# EAGLE board LED (EAGLE 9.5.2)
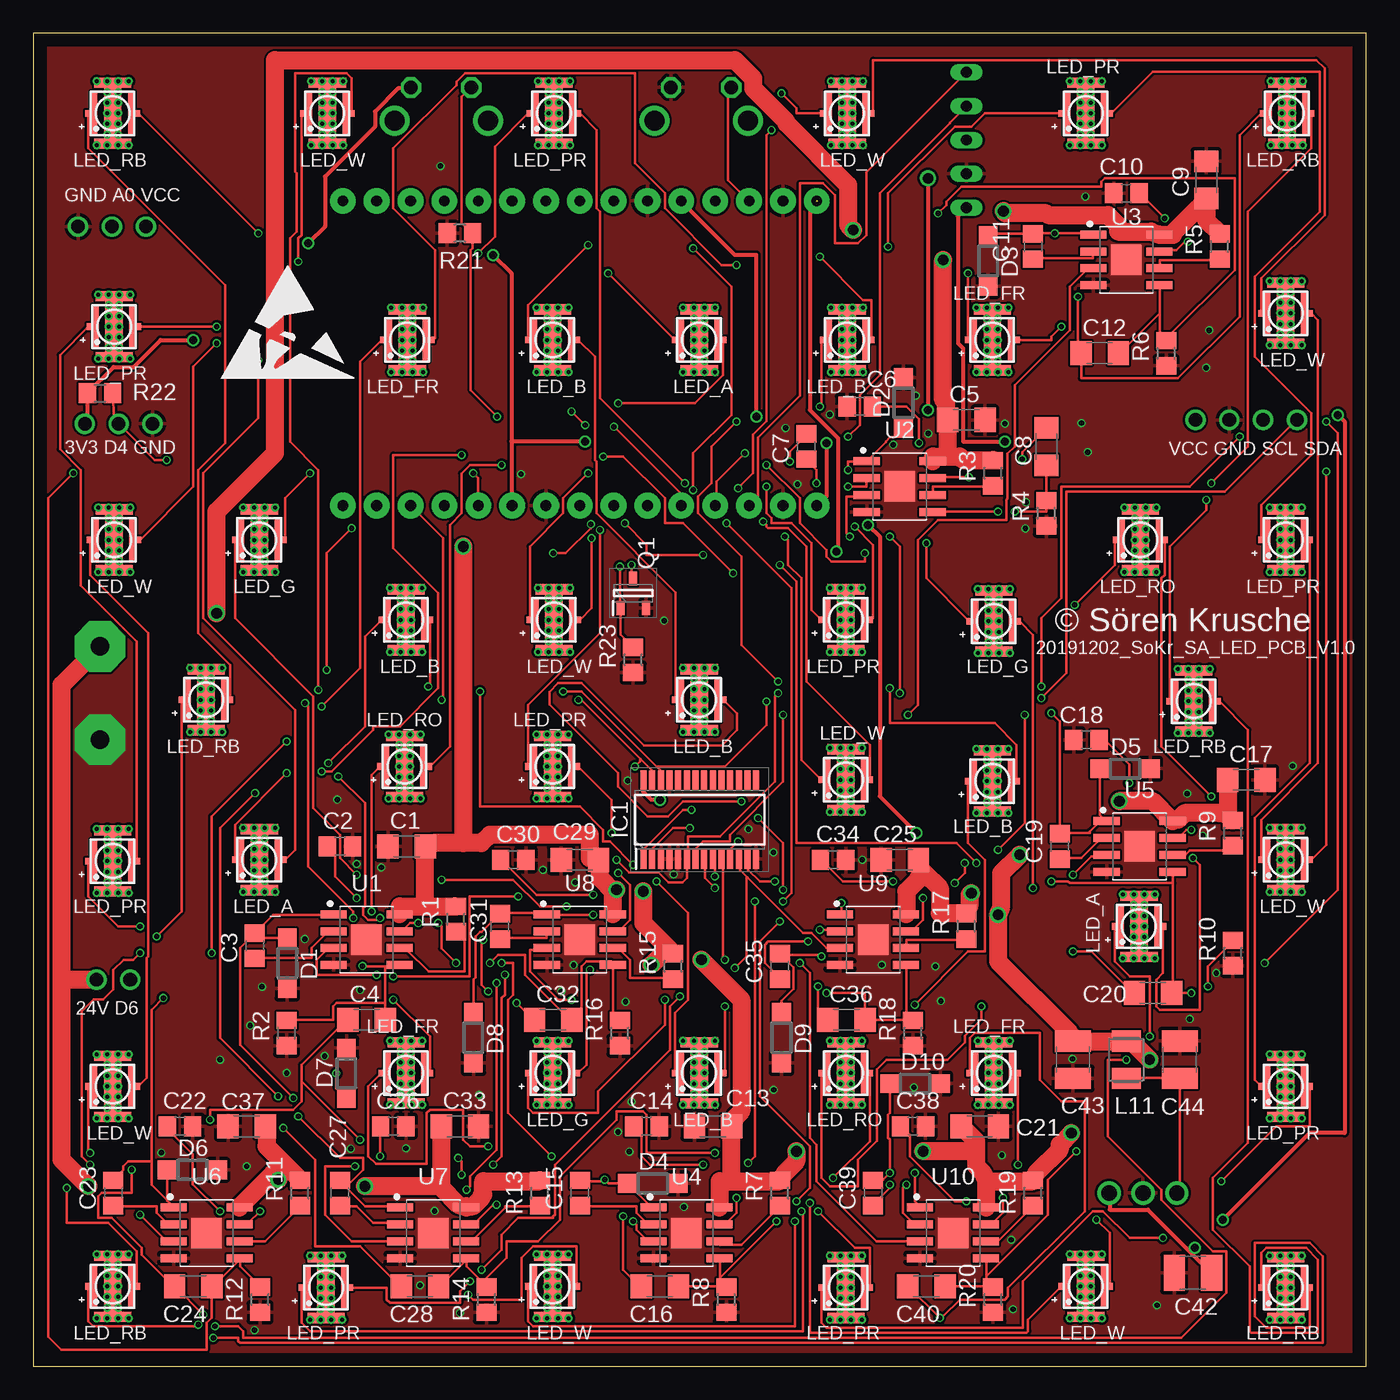
[diagram p5: board, top side]
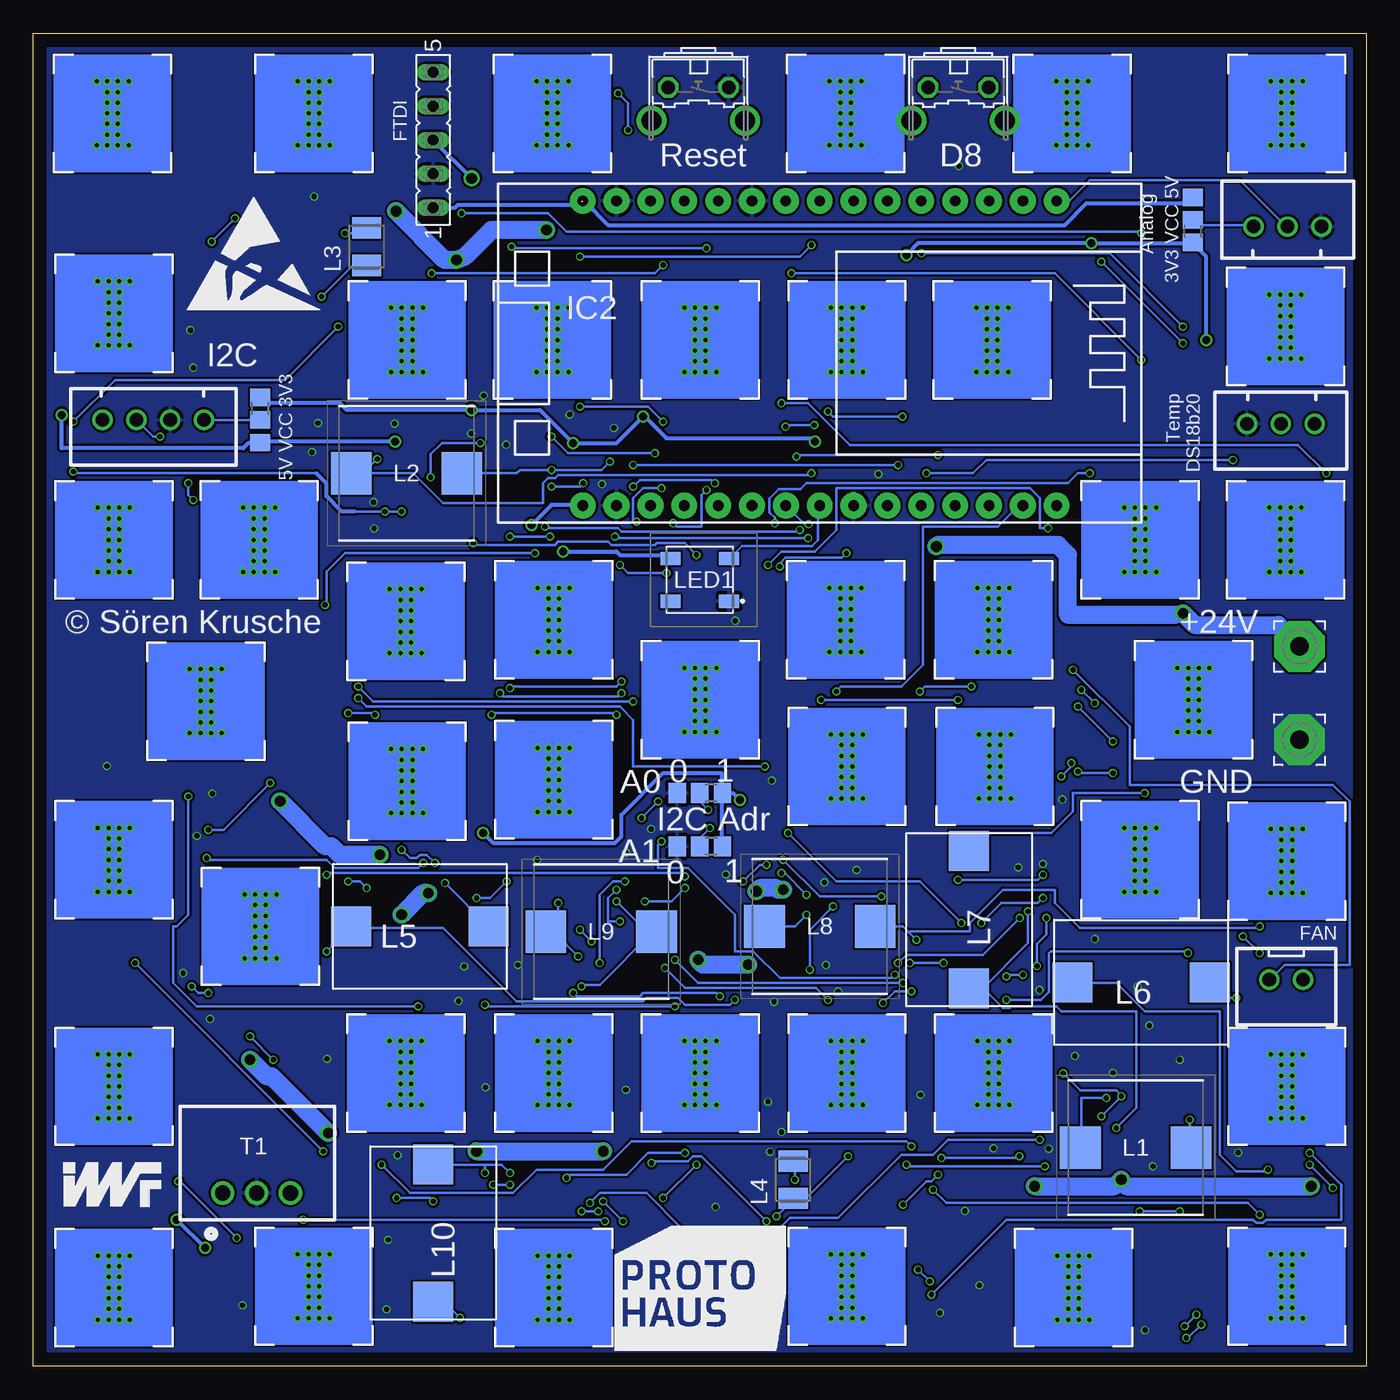
[diagram p6: board, bottom side, seen from below]

Size 100 x 100 mm. Coordinates in mm from the lower left corner, seen from the top.
Outline: 0,0 100,0 100,100 0,100 0,0
Copper layers (1*16): Top 0.035mm / dielectric 1.5mm / Bottom 0.035mm
Design rules "default *": minimum track width 5mil, minimum drill 0.3mm, track to track 5mil, track to pad 5mil, pad to pad 5mil, via to via 5mil, smd to smd 5mil, copper to edge 40mil, drill to drill 6mil, minimum pad ring 3mil, minimum via ring 3mil, stop-mask expansion 4mil, vias tented up to drill 0mil, thermal gap 10mil
Net classes: 0 min: width 0.178 mm, drill 0.4 mm, clearance 0.178 mm; 1 1A: width 0.305 mm, drill 0.6 mm, clearance 0.178 mm to class 0, clearance 0.178 mm; 2 2A: width 0.762 mm, drill 0.8 mm, clearance 0.178 mm to class 0, clearance 0.178 mm to class 1, clearance 0.178 mm; 3 PWM: width 0.178 mm, drill 0.4 mm, clearance 0.178 mm to class 0, clearance 0.178 mm to class 1, clearance 0.178 mm to class 2, clearance 0.178 mm; 4 3A: width 1.346 mm, drill 0.8 mm, clearance 0.178 mm to class 0, clearance 0.178 mm to class 1, clearance 0.178 mm to class 2, clearance 0.178 mm to class 3, clearance 0.178 mm

## Footprints (pad centres in the part's own frame; a part is rotated, then mirrored left to right if it is on the bottom)
C1206 = smd 1.6 x 1.8: 1 -1.4,0; 2 1.4,0
C0805 = smd 1.3 x 1.5: 1 -0.95,0; 2 0.95,0
C1210 = smd 1.6 x 2.7: 1 -1.4,0; 2 1.4,0
SOD123 = smd 1.4 x 1.4: A 1.9,0; C -1.9,0
SOP65P640X110-28N = smd 1.475 x 0.45: 1 -2.938,4.225; 2 -2.938,3.575; 3 -2.938,2.925; 4 -2.938,2.275; 5 -2.938,1.625; 6 -2.938,0.975; 7 -2.938,0.325; 8 -2.938,-0.325; 9 -2.938,-0.975; 10 -2.938,-1.625; 11 -2.938,-2.275; 12 -2.938,-2.925; 13 -2.938,-3.575; 14 -2.938,-4.225; 15 2.938,-4.225; 16 2.938,-3.575; 17 2.938,-2.925; 18 2.938,-2.275; 19 2.938,-1.625; 20 2.938,-0.975; 21 2.938,-0.325; 22 2.938,0.325; 23 2.938,0.975; 24 2.938,1.625; 25 2.938,2.275; 26 2.938,2.925; 27 2.938,3.575; 28 2.938,4.225
ESP12E_DEVKIT = drill 0.8 pad 1.93: 3V3@0 -11.43,-7.62; 3V3@1 11.43,5.08; 3V3@2 11.43,-17.78; AD0 -11.43,17.78; CLK -11.43,-2.54; CMD -11.43,2.54; D0 11.43,17.78; D1 11.43,15.24; D2 11.43,12.7; D3 11.43,10.16; D4 11.43,7.62; D5 11.43,0; D6 11.43,-2.54; D7 11.43,-5.08; D8 11.43,-7.62; EN -11.43,-10.16; GND@0 -11.43,-5.08; GND@1 -11.43,-15.24; GND@2 11.43,2.54; GND@3 11.43,-15.24; RST -11.43,-12.7; RSV@0 -11.43,15.24; RSV@1 -11.43,12.7; RX 11.43,-10.16; SD0 -11.43,0; SD1 -11.43,5.08; SD2 -11.43,7.62; SD3 -11.43,10.16; TX 11.43,-12.7; VIN -11.43,-17.78
A0R-JMP = smd 1.5 x 1.3: 1 0,1.7; 2 0,0; 3 0,-1.7
INDPM101101X680N = smd 3.05 x 3.2: 1 -4.15,0; 2 4.15,0
L3225M = smd 1.6 x 2.2: 1 -1.4,0; 2 1.4,0
PF0382.223NLT = smd 3 x 3: P0 -5.15,0; P1 5.15,0
INPI554FCH = smd 1.5 x 1: 1 2.2,-1.6; 2 2.2,1.6; 3 -2.2,1.6; 4 -2.2,-1.6
CREE_XLAMP = smd 0.5 x 3.3: A -1.4,0; C 1.4,0 | smd 0.45 x 0.5: A@1 -1.825,0; C@1 1.825,0 | drill 0.3 pad 0.6: P$1 0.4,0; P$2 -0.4,0; P$3 0.4,-0.8; P$4 -0.4,-0.8; P$5 0.4,0.8; P$6 -0.4,0.8; P$7 -0.4,1.6; P$8 0.4,1.6; P$9 0.4,2.4; P$10 -0.4,2.4; P$11 1.2,2.4; P$12 -1.2,2.4; P$13 0.4,-1.6; P$14 0.4,-2.4; P$15 -0.4,-1.6; P$16 -0.4,-2.4; P$17 1.2,-2.4; P$18 -1.2,-2.4 | smd 2.794 x 0.762: P$19 0,2.286; P$20 0,-2.286 | smd 1.3 x 3.81: X 0,0
3,81/1,4 = drill 1.397 pad 3.81 octagon: 1 0,0
SOT95P230X110-3N = smd 1.05 x 0.6: 1 -1.1,0.95; 2 -1.1,-0.95; 3 1.1,0
R0805 = smd 1.3 x 1.5: 1 -0.95,0; 2 0.95,0
B3F-31XX = drill 1.016 octagon: 1 -2.261,-1.245; 2 2.261,-1.245 | drill 1.499 pad 2.159: 3 -3.505,1.245; 4 3.505,1.245
FE05-1 = drill 0.813 long: 1 -5.08,0; 2 -2.54,0; 3 0,0; 4 2.54,0; 5 5.08,0
R-78E5.0-1.0 = drill 1.15 pad 1.75: 1 3.21,2; 2 5.75,2; 3 8.29,2
SOIC127P600X170-9T228N = smd 1.968 x 0.599: 1 -2.473,1.905; 2 -2.473,0.635; 3 -2.473,-0.635; 4 -2.473,-1.905; 5 2.473,-1.905; 6 2.473,-0.635; 7 2.473,0.635; 8 2.473,1.905 | smd 2.28 x 2.28: 9 0,0
JST-XH-03-PACKAGE-ROUND-PAD = drill 1.016: 1 -2.54,0; 2 0,0; 3 2.54,0
JST-XH-04-PACKAGE-ROUND-PAD = drill 1.016: 1 -3.81,0; 2 -1.27,0; 3 1.27,0; 4 3.81,0
JST-XH-02-PACKAGE-ROUND-PAD = drill 1.016: 1 -1.27,0; 2 1.27,0

## Placement (x,y rotation side)
C1  1u  [C1206]  28,39 180 top
C2  100n  [C0805]  23,39 0 top
C3  100n  [C0805]  16.62,31.54 90 top
C4  2.2p  [C1206]  25,26 0 top
C5  1u  [C1206]  70,71 0 top
C6  100n  [C0805]  62,72 180 top
C7  100n  [C0805]  58,69 90 top
C8  2.2p  [C1206]  76,69 270 top
C9  1u  [C1206]  88,89 90 top
C10  100n  [C0805]  82,88 180 top
C11  100n  [C0805]  75,84 90 top
C12  2.2p  [C1206]  80,76 0 top
C13  1u  [C1206]  51,18 180 top
C14  100n  [C0805]  46,18 0 top
C15  100n  [C0805]  41,13 90 top
C16  2.2p  [C1206]  47,6 0 top
C17  1u  [C1206]  91,44 0 top
C18  100n  [C0805]  79,47 180 top
C19  100n  [C0805]  77,39 90 top
C20  2.2p  [C1206]  84,28 0 top
C21  1u  [C1206]  71,18 0 top
C22  100n  [C0805]  11,18 0 top
C23  100n  [C0805]  6,13 90 top
C24  2.2p  [C1206]  12,6 0 top
C25  1u  [C1206]  65,38 180 top
C26  100n  [C0805]  27,18 0 top
C27  100n  [C0805]  23,13 90 top
C28  2.2p  [C1206]  29,6 0 top
C29  1u  [C1206]  41,38 180 top
C30  100n  [C0805]  36,38 0 top
C31  100n  [C0805]  35,33 90 top
C32  2.2p  [C1206]  39,26 0 top
C33  1u  [C1206]  32,18 0 top
C34  100n  [C0805]  60,38 0 top
C35  100n  [C0805]  56,30 90 top
C36  2.2p  [C1206]  61,26 0 top
C37  1u  [C1206]  16,18 180 top
C38  100n  [C0805]  66,18 0 top
C39  100n  [C0805]  63,13 90 top
C40  2.2p  [C1206]  67,6 0 top
C42  10u  [C1210]  87,7 180 top
C43  10u  [C1210]  78,23 270 top
C44  10u  [C1210]  86,23 90 top
D1  CMHSH5-4  [SOD123]  19.05,30.23 270 top
D2  CMHSH5-4  [SOD123]  65.28,72.26 90 top
D3  CMHSH5-4  [SOD123]  71.63,82.93 270 top
D4  CMHSH5-4  [SOD123]  46.48,13.72 0 top
D5  CMHSH5-4  [SOD123]  81.92,44.83 0 top
D6  CMHSH5-4  [SOD123]  11.94,14.73 0 top
D7  CMHSH5-4  [SOD123]  23.5,21.97 90 top
D8  CMHSH5-4  [SOD123]  33.02,24.64 270 top
D9  CMHSH5-4  [SOD123]  56.13,24.64 270 top
D10  CMHSH5-4  [SOD123]  66.17,21.21 0 top
IC1  PCA9685PW,112  [SOP65P640X110-28N]  50,41 90 top
IC2  ESP12E_DEVKIT  [ESP12E_DEVKIT]  41,76 270 bottom
JMP1  0R-JUMPA  [A0R-JMP]  50,43 270 bottom
JMP2  0R-JUMPA  [A0R-JMP]  50,39 270 bottom
JMP3  0R-JUMPA  [A0R-JMP]  83,71 0 bottom
JMP4  0R-JUMPA  [A0R-JMP]  13,86 180 bottom
L1  16uH  [INDPM101101X680N]  17.3,16.4 0 bottom
L2  16uH  [INDPM101101X680N]  72,67 180 bottom
L3  10uH  [L3225M]  75,84 90 bottom
L4  10uH  [L3225M]  43,14 90 bottom
L5  20uH  [PF0382.223NLT]  71,33 180 bottom
L6  20uH  [PF0382.223NLT]  16.9,28.8 180 bottom
L7  20uH  [PF0382.223NLT]  29.8,33.5 270 bottom
L8  16uH  [INDPM101101X680N]  41,33 0 bottom
L9  16uH  [INDPM101101X680N]  57.4,32.6 0 bottom
L10  20uH  [PF0382.223NLT]  70,10 270 bottom
L11  10uH  [L3225M]  82,23 90 top
LED1  IN-PI554FCH  [INPI554FCH]  50,59 0 bottom
LED_A1  XP-G3  [CREE_XLAMP]  49.96,77 0 top
LED_A2  XP-G3  [CREE_XLAMP]  16.96,38 0 top
LED_A3  XP-G3  [CREE_XLAMP]  82.96,33 0 top
LED_B1  XP-G3  [CREE_XLAMP]  49.96,50 0 top
LED_B2  XP-G3  [CREE_XLAMP]  38.96,77 0 top
LED_B3  XP-G3  [CREE_XLAMP]  61.06,77 0 top
LED_B4  XP-G3  [CREE_XLAMP]  71.96,43.9 0 top
LED_B5  XP-G3  [CREE_XLAMP]  49.96,22 0 top
LED_B6  XP-G3  [CREE_XLAMP]  27.96,56 0 top
LED_FR1  XP-G3  [CREE_XLAMP]  71.96,77 0 top
LED_FR2  XP-G3  [CREE_XLAMP]  28.06,77 0 top
LED_FR3  XP-G3  [CREE_XLAMP]  27.96,22 0 top
LED_FR4  XP-G3  [CREE_XLAMP]  72.06,22 0 top
LED_G1  XP-G3  [CREE_XLAMP]  72.06,55.9 0 top
LED_G2  XP-G3  [CREE_XLAMP]  16.96,62 0 top
LED_G3  XP-G3  [CREE_XLAMP]  38.96,22 0 top
LED_PR1  XP-G3  [CREE_XLAMP]  38.96,45 0 top
LED_PR2  XP-G3  [CREE_XLAMP]  60.96,56 0 top
LED_PR3  XP-G3  [CREE_XLAMP]  39.06,94 0 top
LED_PR4  XP-G3  [CREE_XLAMP]  6.06,78 0 top
LED_PR5  XP-G3  [CREE_XLAMP]  5.96,37.9 0 top
LED_PR6  XP-G3  [CREE_XLAMP]  21.96,5.9 0 top
LED_PR7  XP-G3  [CREE_XLAMP]  60.96,5.9 0 top
LED_PR8  XP-G3  [CREE_XLAMP]  93.96,21 0 top
LED_PR9  XP-G3  [CREE_XLAMP]  93.96,62 0 top
LED_PR10  XP-G3  [CREE_XLAMP]  78.96,94 0 top
LED_RB1  XP-G3  [CREE_XLAMP]  5.96,94 0 top
LED_RB2  XP-G3  [CREE_XLAMP]  12.96,50 0 top
LED_RB3  XP-G3  [CREE_XLAMP]  5.96,6 0 top
LED_RB4  XP-G3  [CREE_XLAMP]  93.96,5.9 0 top
LED_RB5  XP-G3  [CREE_XLAMP]  87.06,49.9 0 top
LED_RB6  XP-G3  [CREE_XLAMP]  94.06,94 0 top
LED_RO1  XP-G3  [CREE_XLAMP]  60.96,22 0 top
LED_RO2  XP-G3  [CREE_XLAMP]  83.06,62 0 top
LED_RO3  XP-G3  [CREE_XLAMP]  27.86,45 0 top
LED_W1  XP-G3  [CREE_XLAMP]  22.06,94 0 top
LED_W2  XP-G3  [CREE_XLAMP]  6.06,62 0 top
LED_W3  XP-G3  [CREE_XLAMP]  5.96,21 0 top
LED_W4  XP-G3  [CREE_XLAMP]  38.96,6 0 top
LED_W5  XP-G3  [CREE_XLAMP]  78.96,6 0 top
LED_W6  XP-G3  [CREE_XLAMP]  93.96,38 0 top
LED_W7  XP-G3  [CREE_XLAMP]  93.96,79 0 top
LED_W8  XP-G3  [CREE_XLAMP]  61.06,94 0 top
LED_W9  XP-G3  [CREE_XLAMP]  60.96,44 0 top
LED_W10  XP-G3  [CREE_XLAMP]  39.06,56 0 top
PAD1  +24V  [3,81/1,4]  5,54 0 bottom
PAD2  GND  [3,81/1,4]  5,47 0 bottom
Q1  BSH103,215  [SOT95P230X110-3N]  45,58 90 top
R1  200k 1%  [R0805]  31.7,33.54 90 top
R2  390m  [R0805]  19,25 90 top
R3  200k 1%  [R0805]  72,67 90 top
R4  390m  [R0805]  76,64 90 top
R5  200k 1%  [R0805]  89,84 90 top
R6  300m  [R0805]  85,76 90 top
R7  200k 1%  [R0805]  56,13 90 top
R8  240m  [R0805]  52,5 90 top
R9  59k 1%  [R0805]  90,40 90 top
R10  470m  [R0805]  90,31 90 top
R11  59k 1%  [R0805]  20,13 90 top
R12  470m  [R0805]  17,5 90 top
R13  59k 1%  [R0805]  38,13 90 top
R14  470m  [R0805]  34,5 90 top
R15  59k 1%  [R0805]  48,30 90 top
R16  470m  [R0805]  44,25 90 top
R17  59k 1%  [R0805]  70,33 90 top
R18  470m  [R0805]  66,25 90 top
R19  59k 1%  [R0805]  75,13 90 top
R20  470m  [R0805]  72,5 90 top
R21  4k7  [R0805]  32,85 180 top
R22  4k7  [R0805]  5,73 0 top
R23  4k7  [R0805]  45,53 90 top
S1  D8  [B3F-31XX]  30.6,94.7 180 bottom
S2  RST  [B3F-31XX]  50.1,94.7 180 bottom
SV1  FTDI  [FE05-1]  70,92 90 bottom
T1  R-78E5.0-1.0  [R-78E5.0-1.0]  89,11 0 bottom
U1  LM3402/02HV  [SOIC127P600X170-9T228N]  25,32 0 top
U2  LM3402/02HV  [SOIC127P600X170-9T228N]  65,66 0 top
U3  LM3402/02HV  [SOIC127P600X170-9T228N]  82,83 0 top
U4  LM3402/02HV  [SOIC127P600X170-9T228N]  49,10 0 top
U5  LM3402/02HV  [SOIC127P600X170-9T228N]  83,39 0 top
U6  LM3402/02HV  [SOIC127P600X170-9T228N]  13,10 0 top
U7  LM3402/02HV  [SOIC127P600X170-9T228N]  30,10 0 top
U8  LM3402/02HV  [SOIC127P600X170-9T228N]  41,32 0 top
U9  LM3402/02HV  [SOIC127P600X170-9T228N]  63,32 0 top
U10  LM3402/02HV  [SOIC127P600X170-9T228N]  69,10 0 top
U$1  [ESD_10.00]  14,74 0 top
U$2  [ESD_10.00]  88.55,79.13 0 bottom
X1  JST-XH-03-PIN-ROUND-PAD  [JST-XH-03-PACKAGE-ROUND-PAD]  5.9,85.5 0 bottom
X2  JST-XH-04-PIN-ROUND-PAD  [JST-XH-04-PACKAGE-ROUND-PAD]  91,71 180 bottom
X3  JST-XH-03-PIN-ROUND-PAD  [JST-XH-03-PACKAGE-ROUND-PAD]  6.4,70.71 180 bottom
X4  JST-XH-02-PIN-ROUND-PAD  [JST-XH-02-PACKAGE-ROUND-PAD]  6,29 180 bottom

## Tracks (layer width: path | path; a pad name or v marks a point on that pad's centre or on a via)
+3V3  (via drill 0.6, 0.8)
  Top 0.305: v20.62,84.25 21.88,85.5 21.88,89.25 25.62,93 25.62,94.12 27.38,95.88 28.25,95.88 S1.1 | 35.88,69.38 35.88,82 v34.5,83.38 | 35.88,69.38 35.88,64.62 IC2.3V3@1 | v47,42.5 46.38,42.5 45.75,43.12 45.75,43.88 IC1.28 | v67.12,89.12 v67.12,71.75 | v59.5,69.25 59.5,65.25 58.88,64.62 IC2.3V3@2 | v54.25,71.25 54.25,83.38 52.62,83.38 48.62,87.38 IC2.3V3@0 | v66.25,40 63.5,42.75 63.5,62.25 v62.62,63.12 | v41.38,69.38 35.88,69.38 | X3.1 4.05,70.9 R22.1 6.02,74.97 7.52,74.97 9.55,77 v12,77
  Bottom 0.305: 13,84.25 v20.62,84.25 33.62,84.25 v34.5,83.38 | 13,84.25 JMP4.1 | v47,42.5 47.5,43 JMP1.1 | JMP2.1 48.38,39 48.38,42.88 JMP1.1 | SV1.3 v67.12,89.12 | JMP3.1 83,72.62 82.62,72.25 77,72.25 76.5,71.75 v67.12,71.75 62,71.75 v59.5,69.25 56.25,69.25 v54.25,71.25 54.12,71.25 52.5,69.62 41.62,69.62 v41.38,69.38 | v66.25,40 65.5,39.25 56.38,39.25 55.88,39.75 55.88,41.38 52.75,44.5 48.38,44.5 48.38,43.12 JMP1.1 | v62.62,63.12 61.12,64.62 58.88,64.62 IC2.3V3@2 | v12,77 12,83.25 13,84.25
+5V  (via drill 0.6)  (3 unrouted)
  Top 0.305: v60.25,61.12 60.38,61.25 60.38,69.62 58.25,71.75 58.25,86.88 58.75,87.38 | 86.81,8.56 83.62,11.75 80.75,11.75 80.75,13 T1.3 | 86.81,8.56 88.38,7 C42.1 | v72.88,69.38 69.75,69.38 69.75,76.38 69.38,76.75 69.38,86 69.38,86.25 69.38,86.3 SV1.1 | v87.12,8.88 86.81,8.56 | v89.25,11 95.75,17.5 98.38,17.5 98.38,70.88 v97.88,71.38
  Bottom 0.305: v60.25,61.12 56.25,61.12 56,60.88 52.5,60.88 52.25,60.62 LED1.3 | 58.75,87.38 58.62,87.38 56.88,85.62 22.62,85.62 21,87.25 13.38,87.25 13,87.62 JMP4.3 | v72.88,69.38 83,69.38 JMP3.3 83.12,69.25 83.88,69.25 84.25,68.88 97.88,68.88 v97.88,71.38 | v89.25,11 v87.12,8.88 | SV1.1 68.35,86.92 68.14,87.13 59.12,87.13 58.88,87.38
+24V  (via drill 0.8)
  Top 1.346: 52.38,13.88 51.5,13.88 51.5,12 U4.8 | 52.38,13.88 56,13.88 R7.2 56.38,14.5 57.25,15.38 v57.25,16.12 | 52.38,13.88 52.38,18 C13.1 52.62,18.62 53.12,19.12 53.12,27.5 v50.12,30.5 | 29.38,34.5 27.5,34.5 27.5,34 U1.8 | 29.38,34.5 31.62,34.5 R1.2 | 29.38,34.5 29.38,39 C1.1 30,39.25 32.25,39.25 | 47.56,31.44 45.75,33.25 v45.75,35.62 | 47.56,31.44 48,31 R15.2 | 43.56,35.56 43.5,35.5 43.5,34 U8.8 | 43.56,35.56 v43.75,35.75 | 43.56,35.56 42.5,36.62 42.5,38 C29.1 41.75,38.12 41.75,39.88 34.25,39.88 33.62,39.25 32.25,39.25 | v46.38,30.12 47.12,30.88 47.12,31 47.56,31.44 | 71.5,13.88 75,13.88 R19.2 75.25,14.5 77,16.25 77,16.62 v77.88,17.5 | 71.5,13.88 71.5,12 U10.8 | 70.75,16.12 70.75,15 71.25,14.5 71.5,13.88 | 70.75,16.12 70.75,16.88 69.62,18 C21.1 | 89.62,41.38 90,41 R9.2 | 89.62,41.38 89.62,44 C17.1 | 89.62,41.38 89,41.5 86.38,41.5 85.88,41 85.5,41 U5.8 83.98,42.4 v81.49,42.4 | 70,34 68,34 68,35.88 66.81,37.06 | 66.81,37.06 66.5,37.38 66.5,38 C25.1 | 70,34 R17.2 | U9.8 65.5,34 65.5,35.62 66.38,36.5 66.38,36.62 66.81,37.06 | v70.38,35.5 70.25,35.38 70.25,34.62 70,34 | v74,38.38 72.62,37 72.62,34.5 v72.38,33.88 72.38,30.38 77.75,25 C43.1 78,24.38 82,24.38 L11.2 82.62,24.12 v83.75,23 | 70.75,16.12 v66.75,16.12 | R5.2 89,85 88,86 C9.1 87.38,86.88 85.5,85 85.5,84.88 84.5,84.88 U3.8 83.88,85.12 81.38,85.12 81.38,85.62 80.62,86.38 76.12,86.38 76,86.5 72.94,86.5 v72.79,86.66 | 68.62,68.25 67.5,68.25 67.5,68 U2.8 | 68.62,68.25 69.5,68.25 69.75,68 72,68 R3.2 | 68.62,68.25 68.62,71 C5.1 68.5,71.62 68.5,72.25 68.25,72.5 v68.25,83 | 18.69,15.31 17.5,16.5 17.5,18 C37.1 | 18.69,15.31 20,14 R11.2
  Top 1.346: 17.94,14.44 18.25,14.75 18.25,14.88 18.69,15.31 | 17.94,14.44 15.5,12 U6.8 | R13.2 38,13.88 33.75,13.88 33.75,12.88 33.62,12.75 33.62,12.62 33,12 32.5,12 U7.8 31.88,12.12 30.62,13.38 30.62,13.5 | 30.62,13.5 30.62,18 C33.1 | 30.62,13.5 v24.88,13.5 | v18.38,14 17.94,14.44 | 2.12,29 2.12,15.5 v4.12,13.5 | 2.12,29 2.12,51.12 PAD1.1 | v61.5,85.25 61.12,85.62 61.12,88.62 56.5,93.25 56.5,93.38 54,95.88 54,96.62 52.62,98 18.12,98 18.12,68.5 13.75,64.12 v13.75,56.5 | v32.25,61.5 32.25,39.25 | X4.1 2.12,29
  Bottom 1.346: v45.75,35.62 45.5,35.88 44.25,35.88 44.12,35.75 v43.75,35.75 | v50.12,30.5 49.75,30.12 v46.38,30.12 | v72.38,33.88 70.75,35.5 v70.38,35.5 | v81.49,42.4 78.09,39 77.62,39 77,38.38 v74,38.38 | v77.88,17.5 82.12,21.75 82.5,21.75 v83.75,23 | v66.75,16.12 v57.25,16.12 | v72.79,86.66 69.13,83 v68.25,83 67.62,83.25 65.62,85.25 v61.5,85.25 | 18.44,13.94 18.88,13.5 v24.88,13.5 | 18.44,13.94 v18.38,14 | v4.12,13.5 18,13.5 18.44,13.94 | v32.25,61.5 32.12,61.62 23.12,61.62 22.38,60.88 22.38,56.38 14.38,56.38 v13.75,56.5 12.88,55.62 6.62,55.62 PAD1.1
A0
  Bottom 0.178: X1.2 6,85.5 9.5,89 20.75,89 22.25,87.5 23.12,87.5 IC2.AD0
D4  (via drill 0.4)
  Top 0.178: v10,68 9.11,68 X3.2 6.05,71.06 R22.2 | IC2.D4 33.38,66.62 v33,67
  Bottom 0.178: v10,68 28.51,68 29.51,67 v33,67
D6  (via drill 0.4)
  Top 0.178: v41.83,63.17 41.83,62.88 39.95,61 v39,61 | Q1.1 44,56.95 v44,60
  Top 0.2: R23.2 44.05,54.9 Q1.1
  Bottom 0.178: IC2.D6 42.29,63.32 42.27,63.32 42.12,63.17 v41.83,63.17 | v39,61 39.33,60.67 43.57,60.67 44,60.24 v44,60
GND  (via drill 0.4)
  other vias: 9.6,16.02 16,15 14,23 19,22 32,4 30.11,11.65 33.43,20.36 23.82,16.32 27.96,16.34 29.02,6.07 16.59,2.71 73.5,4.27 48.81,11.95 44.72,16.1 44.88,19.84 43.87,17.57 84.31,4.57 24.52,28.22 20.37,32.04 22.8,42.51 44.43,27.34 40.53,30.1 39.62,28.12 40.65,36.29 38.23,37.23 77.97,23.06 86.75,26.05 88.76,29.49 87.73,39.8 86.57,42.96 94.48,45.03 63.65,30.11 67.68,30 68.1,27.39 62.19,38 55.53,38.54 48.04,36.9 53.65,40.29 44.59,43.93 64.52,69.13 57.33,66.17 59.76,71.4 56.44,70.39 66.21,72.82 67.14,69.98 74.48,64.82 74.43,62.86 79.1,68.57 78.64,70.76 72.89,70.72 87.99,74.91 88.22,77.72 78.93,87.76 30.55,90.05 24.26,37.68 26.11,37.42 47.34,55.93 36.59,66.93 21.85,23.27 16.27,25.55 17.15,28.47 55.55,20.73 73.37,9.48 66.07,20.91 72.67,15.83
  pour Top (rank 2): -7,105 104,105 104,-3 -5,-3 -5,103
  pour Bottom (rank 2): -9,107 106,107 107,106 107,-4 105,-6 -5,-6 -9,-2
  pour Top (no thermals): 2,50 9,50 9,44 2,44
  pour Bottom (no thermals): 2,50 8,50 8,44 2,44
N$1
  Top 0.178: LED_W6.A LED_W6.A@1 92.12,41 96.38,45.25 96.38,78.5 95.88,79 LED_W7.C@1 LED_W7.C
N$2
  Top 0.178: LED_W7.A LED_W7.A@1 92.12,81.62 96.88,86.38 96.88,97.38 96.25,98 63,98 63,94 LED_W8.C@1 LED_W8.C
N$3  (via drill 0.4)
  Top 0.178: LED_W8.A LED_W8.A@1 57.25,94 57.25,94.38 v56.12,95.5 | LED_W9.C 62.75,44 | v55.38,92.75 55,92.38 55,70.89 54,69.89 54,67 v52.88,65.88 | v54.75,63.38 55,63.12 55,63 55.12,62.88 56.62,62.88 58,61.5 58,51.38 62.75,46.62 62.75,44 | 62.75,44 LED_W9.C@1
  Bottom 0.178: v56.12,95.5 55.38,94.75 v55.38,92.75 | v52.88,65.88 54.25,65.88 55,65.12 55,63.38 v54.75,63.38
N$4  (via drill 0.4)
  Top 0.178: LED_W10.C LED_W10.C@1 41,56 41.88,56.88 v41.88,62.12 | LED_W9.A LED_W9.A@1 57.62,45.5 57.62,59.12 56.62,60.12 56.62,62 v56.38,62.25
  Bottom 0.178: v41.88,62.12 56.25,62.12 v56.38,62.25
N$5
  Top 0.178: R3.1 72,66 67.5,66 67.5,65.38 U2.6
N$6
  Top 0.178: R1.1 31.75,32.5 32.37,31.88 32.37,29.62 29.64,29.62 29.64,29.61 28,31.25 27.5,31.25 U1.6
N$7
  Top 0.178: C3.1 16.62,30.62 20.88,30.62 20.88,31.38 22.12,32.62 22.5,32.62 U1.2
N$8  (via drill 0.4)
  Top 0.178: U1.1 22.5,33.88 17.98,33.88 16.62,32.52 C3.2 16.5,32.38 | v19.5,20.12 15.5,24.12 15.5,31.38 16.5,32.38 | D1.C 16.75,32.13 16.5,32.38
  Bottom 0.178: v19.5,20.12 21.38,20.12 21.38,16.5 L1.1
N$9  (via drill 0.4)
  Top 0.178: v24.25,35.12 22.62,36.75 22.62,38.5 22.12,39 C2.1 | v28.88,33.25 28.25,33.25 27.75,32.75 27.5,32.75 U1.7
  Bottom 0.178: v24.25,35.12 24.62,34.75 27.38,34.75 v28.88,33.25
N$10  (via drill 0.4)
  Top 0.178: LED_W2.C LED_W2.C@1 8,62 12,66 12,75 v13.75,76.75 | LED_W1.A LED_W1.A@1 20.12,94 20.12,84.88 19.88,84.62 v19.88,82.88
  Bottom 0.178: v19.88,82.88 v13.75,76.75
N$11
  Top 0.178: LED_W3.C LED_W3.C@1 7.88,21 8.5,21.62 8.5,30.62 8.62,30.75 8.62,55 4.25,59.38 4.25,62 | LED_W2.A 4.25,62 | 4.25,62 LED_W2.A@1
N$12  (via drill 0.4)
  Top 0.178: LED_W3.A LED_W3.A@1 4.12,16.12 v4.25,16 | LED_W4.C 40.75,6 | v32.62,5.38 33,5 36.62,5 36.62,8.12 37.5,9 40.75,9 40.75,6 | 40.75,6 LED_W4.C@1
  Bottom 0.178: v4.25,16 1.88,13.62 1.88,11 7.5,11 7.75,10.75 8.25,10.75 8.5,11 27,11 v32.62,5.38
N$13  (via drill 0.4)
  Top 0.178: LED_W4.A LED_W4.A@1 37.12,3.38 37.5,3 57.12,3 v57.12,10.88 | LED_W5.C 80.75,6 | v79.75,11 80.75,10 80.75,6 | 80.75,6 LED_W5.C@1
  Bottom 0.178: v57.12,10.88 57.25,11 v79.75,11
N$14  (via drill 0.4)
  Top 0.178: 85.25,50 85.62,50 LED_RB5.A | LED_RB6.C 95.88,94 | 85.25,50 85.25,61.5 88,64.25 v88,65 | v88.38,66.25 91.12,69 91.12,86.62 95.88,91.38 95.88,94 | 85.25,50 LED_RB5.A@1 | 95.88,94 LED_RB6.C@1
  Bottom 0.178: v88,65 88.38,65.38 v88.38,66.25
N$15  (via drill 0.4)
  Top 0.178: LED_W1.C LED_W1.C@1 | 26.38,27.25 22.75,27.25 22.5,27 22.5,26 19,26 R2.2 | 26.38,27.25 26.38,26 C4.2 | 26.38,30 27.38,30 U1.5 | 26.38,27.25 26.38,30 | LED_W1.C@1 23.88,96.62 23.5,97 19.62,97 19.62,89.62 19.75,89.5 19.75,85.12 19.25,84.62 19.25,69.38 21.38,67.25 v21.38,50.75 | v20.38,49.75 20.62,49.5 20.62,37.5 24,34.12 v24,33.62 | 26.38,30 24.7,30 v24.69,30.02 | LED_W1.C@1
  Bottom 0.178: v20.38,49.75 v21.38,50.75 | v24,33.62 24,32.38 24.69,31.7 v24.69,30.02
N$16  (via drill 0.4)
  Top 0.178: v58.75,66.25 58.75,67.25 58,68 C7.1 | v61.12,66 62.5,66 62.5,66.62 U2.2
  Bottom 0.178: v58.75,66.25 59,66 v61.12,66
N$17  (via drill 0.4)
  Top 0.178: v56.75,67.88 56.75,68.62 58,69.88 C7.2 | 62.5,67.88 61.12,67.88 v61.12,67.25 | 62.5,67.88 U2.1 | D2.C 64.61,69.7 64.28,69.7 63.95,69.36 63.95,69.33 62.5,67.88
  Bottom 0.178: v56.75,67.88 57.38,67.25 v61.12,67.25 63.5,67.25 63.75,67 L2.1
N$18  (via drill 0.4)
  Top 0.178: v66.45,69.27 66.45,71.05 65.5,72 C6.1 | v70.19,66.69 67.56,66.69 67.5,66.62 U2.7
  Bottom 0.178: v70.19,66.69 70.19,68.42 69.34,69.27 v66.45,69.27
N$19
  Top 0.178: LED_B2.C LED_B2.C@1 40.88,77 42.12,75.75 42.12,68 42.25,67.88 42.25,64 48.19,58.06 48.19,50.37 LED_B1.A LED_B1.A@1
N$20  (via drill 0.4)
  Top 0.178: LED_W10.A 37.25,56 | v74.19,68.06 74.19,68.56 76,70.38 C8.1 | 37.25,56 37.25,61.5 39.75,64 39.75,65.12 v41.62,67 | 37.25,56 LED_W10.A@1
  Bottom 0.178: v74.19,68.06 75.25,67 L2.2 71.5,67 69.25,64.75 61.75,64.75 61.75,66.25 61.38,66.62 60.88,66.62 60.62,66.88 41.75,66.88 v41.62,67
N$21  (via drill 0.4)
  Top 0.178: LED_B2.A LED_B2.A@1 37.12,79.62 v41.62,84.12 | LED_B3.C 62.88,77 | v59,83.25 62.25,80 62.88,80 62.88,77 | 62.88,77 LED_B3.C@1
  Bottom 0.178: v41.62,84.12 42.5,83.25 v59,83.25
N$22  (via drill 0.4)
  Top 0.178: 73.75,44 73.38,44 LED_B4.C | LED_B3.A LED_B3.A@1 59.12,77 59.12,72.12 v59,72 | 73.75,44 73.75,46.62 72.12,48.25 64.25,48.25 v64.25,50.88 | v55.88,51.38 53.12,54.12 53.12,60.75 49.88,64 49.88,65.25 50.88,66.25 50.88,69 v52.75,70.88 | 73.75,44 LED_B4.C@1
  Bottom 0.178: v64.25,50.88 64.12,51 56.25,51 v55.88,51.38 | v52.75,70.88 53.88,72 v59,72
N$23  (via drill 0.4)
  Top 0.178: LED_B5.C LED_B5.C@1 51.88,22 v51.88,27 | LED_B4.A 70.5,44 70.25,44 LED_B4.A@1 70.12,43.88 70.12,39.25 71.38,38 71.38,31.12 70.12,31.12 v66.12,27.12
  Bottom 0.178: v51.88,27 66,27 v66.12,27.12
N$24  (via drill 0.4)
  Top 0.178: LED_B5.A LED_B5.A@1 48.12,26.5 49.12,27.5 49.12,34 v46.75,36.38 | LED_B6.C 29.75,56 | v45,37.62 43.25,39.38 42.75,39.38 42.75,40.25 41,42 33.5,42 v33.5,50.62 | v29.62,51 29.75,51.12 29.75,56 | 29.75,56 LED_B6.C@1
  Bottom 0.178: v46.75,36.38 45.5,37.62 v45,37.62 | v33.5,50.62 33.12,51 v29.62,51
N$25  (via drill 0.4)
  Top 0.178: v49.38,41.75 48.75,41.75 45.88,38.88 45.88,38.12 IC1.1
  Bottom 0.178: v49.38,41.75 50,42.38 JMP1.2
N$26  (via drill 0.4)
  Top 0.178: S1.2 32.75,95.88 32.12,95.25 32.12,85.75 32.88,85 R21.1 32.95,83.88 32.81,83.73 32.81,73.24 v34.8,71.25 | v40.39,71.63 v41.4,70.61 | v43.56,70.48 48.62,65.43 IC2.D8
  Bottom 0.178: v34.8,71.25 40.01,71.25 v40.39,71.63 | v41.4,70.61 43.43,70.61 v43.56,70.48
N$27  (via drill 0.4)
  Top 0.178: LED_W6.C LED_W6.C@1 95.88,38 97,39.12 v97,67.12 | C8.2 R4.2 76,64.12 v73.62,64.12 | v72.38,64.12 67.5,64.12 U2.5
  Bottom 0.178: v72.38,64.12 v73.62,64.12 75.89,64.12 | v97,67.12 96.88,67 78.77,67
  Bottom 0.305: 78.77,67 78,66.23 78,65.26 76.87,64.12 75.89,64.12
N$28
  Top 0.178: LED_RB1.A LED_RB1.A@1 4.12,91.38 14.38,81.12 14.38,69.25 12.38,67.25 12.38,55 14.75,52.62 14.75,50 | LED_RB2.C 14.75,50 | 14.75,50 LED_RB2.C@1
N$29  (via drill 0.4)
  Top 0.178: LED_RB3.C 7.75,6 | LED_RB2.A LED_RB2.A@1 11.12,50 11.12,34.12 v9.25,32.25 | 7.75,6 7.75,8.62 5.62,10.75 2.5,10.75 v2.5,13.38 | v4.25,15.12 3.62,15.75 3.62,26.62 4.52,27.52 5.24,27.52 6,28.29 6,29.74 6.76,30.5 7.5,30.5 v8,31 | 7.75,6 LED_RB3.C@1
  Bottom 0.178: v4.25,15.12 v2.5,13.38 | v9.25,32.25 v8,31
N$30  (via drill 0.4)
  Top 0.178: LED_RB3.A LED_RB3.A@1 4.12,3.38 4.5,3 12.38,3 v12.38,3.12 | LED_RB4.C 95.38,6 95.75,6 LED_RB4.C@1 95.75,5.88 95.75,2.88 92.5,2.88 91.62,3.75 91.62,9.25 95.75,9.25 96.75,8.25 96.75,1.75 15.5,1.75 15.38,1.88 15.38,2.12 v13.5,2.12
  Bottom 0.178: v12.38,3.12 13.38,2.12 v13.5,2.12
N$31
  Top 0.178: LED_RB5.C 88.5,50 88.88,50 LED_RB5.C@1 89,49.88 91.12,47.75 91.12,16.75 88.5,14.12 88.5,10.25 91.25,7.5 91.25,2.62 91.38,2.5 96.38,2.5 96.38,8 95.5,8.88 92.5,8.88 92.12,8.5 92.12,6 LED_RB4.A@1 92.25,6 92.5,6 LED_RB4.A
N$32
  Top 0.178: R5.1 89,83 84.5,83 84.5,82.38 U3.6
N$33
  Top 0.178: C11.1 75,83.12 79.5,83.12 79.5,83.62 U3.2
N$34  (via drill 0.4)
  Top 0.178: U3.1 79.5,85 v76.62,85 75,85 C11.2 71.75,84.95 D3.C
  Bottom 0.178: v76.62,85 75.38,85 75,85.38 L3.2
N$35  (via drill 0.4)
  Top 0.178: v84.88,86.12 83,88 C10.1 | v86.62,84.38 86.38,84.38 85.75,83.75 84.5,83.75 U3.7
  Bottom 0.178: v86.62,84.38 v84.88,86.12
N$36  (via drill 0.4)
  Top 0.178: LED_RB6.A LED_RB6.A@1 92.12,94 90.5,92.38 90.5,78.75 85.88,74.12 78.62,74.12 78.62,76 C12.1 78.5,76 78.38,76.12 v78.38,80.25
  Bottom 0.178: v78.38,80.25 76.12,82.5 75,82.5 L3.1
N$37  (via drill 0.4)
  Top 0.178: LED_RB1.C LED_RB1.C@1 7.88,94 v16.88,85 | 84.5,79 84.5,81 U3.5 | 84.5,79 84.5,77.5 85,77 R6.2 85,77.12 90.12,82.25 90.12,89.12 80.38,89.12 80.12,88.88 80.12,88.5 69.62,88.5 68.5,87.38 68.5,87.12 v67.88,86.5 | 84.5,79 81.5,76 C12.2
  Bottom 0.178: v16.88,85 17,85.12 60,85.12 61.38,86.5 v67.88,86.5
N$38
  Top 0.178: L11.1 82,21.62 86,21.62 C44.1 86,13.12 85.88,13 T1.1
N$39  (via drill 0.4)
  Top 0.178: v49.25,40.38 48,40.38 46.5,38.88 46.5,38.12 IC1.2
  Bottom 0.178: v49.25,40.38 50,39.62 JMP2.2
N$40
  Bottom 0.178: X2.1 JMP3.2
N$41
  Top 0.178: S2.2 52.25,95.88 52.12,95.75 52.12,89 53.62,87.5 IC2.RST
N$42
  Bottom 0.178: JMP4.2 12.62,85.62 8.62,85.62 8.5,85.5 X1.1
N$43
  Bottom 0.178: LED1.2 47.75,60.62 46.84,61.53 41.59,61.53 41.12,62 41.12,64.5 41,64.5 IC2.D5
N$44  (via drill 0.4)
  Top 0.178: v61.12,69.75 62,70.62 62,72.88 63.5,74.38 63.5,88 68.75,93.25 68.75,93.29 SV1.4 | v53.38,68.5 51.25,66.38 51.25,64.62 IC2.RX
  Bottom 0.178: v61.12,69.75 59.88,68.5 v53.38,68.5
N$45
  Top 0.178: IC2.TX 53.75,64.62 54.38,65.25 54.38,69.69 57.5,72.81 57.5,88.75 59.25,88.75 60.12,87.88 60.12,84.25 61.88,84.25 62.5,84.88 62.5,89 62.5,89.5 62.5,89.58 SV1.5
N$46  (via drill 0.4)
  Top 0.178: v44.88,60.12 44.88,59.25 45,59.12 Q1.3 | v23.88,62.88 22,61 v22,52.25
  Bottom 0.178: v44.88,60.12 43.88,61.12 41.38,61.12 39.75,62.75 39.75,65.88 25.25,65.88 24.5,65.12 24.5,62.88 v23.88,62.88 | v22,52.25 17.75,48 17.75,43.62 2.5,43.62 1.25,42.38 1.25,30.12 6.12,30.12 7.25,29 X4.2
N$48
  Top 0.178: R7.1 56,12 53.12,9.12 51.5,9.12 51.5,9.25 U4.6
N$49
  Top 0.178: C15.1 41,12 45.25,12 45.25,11.5 46,10.75 46.5,10.75 U4.2
N$50  (via drill 0.4)
  Top 0.178: C15.2 41,13.88 42.87,13.88 v42.87,14 43.16,13.72 D4.C 46.3,12 46.5,12 U4.1
  Bottom 0.178: L4.2 42.87,15.27 v42.87,14
N$51  (via drill 0.4)
  Top 0.178: v50.25,15.12 46.25,15.12 45.62,15.75 45.62,17.5 45.12,18 C14.1 | v52.75,12.62 52.75,11.5 52,10.75 51.5,10.75 U4.7
  Bottom 0.178: v52.75,12.62 v50.25,15.12
N$52  (via drill 0.4)
  Top 0.178: LED_B6.A LED_B6.A@1 26.12,56 24.88,54.75 24.88,48 v22.12,45.25 | v44.25,11.25 44.25,7.25 45.5,6 C16.1 | v22.88,44.25 24.88,42.25 24.88,34.5 24.75,34.38 24.75,33.88 25.12,33.5 26,33.5 v26,33.62 | v35.12,30.25 36,30.25 36,27.88 35.62,27.5 35.62,19 v38.88,15.75
  Bottom 0.178: v44.25,11.25 43,12.5 L4.1 43,12.62 42,12.62 v38.88,15.75 | v22.12,45.25 22.12,45 v22.88,44.25 | v26,33.62 28.75,30.88 34.5,30.88 v35.12,30.25
N$53  (via drill 0.4)
  Top 0.178: LED_B1.C LED_B1.C@1 52.8,48.98 52.8,47.71 51.66,46.57 45.8,46.57 41.12,51.25 39.38,51.25 38.73,50.6 38.73,49.65 43.85,44.52 43.85,43.48 46.08,41.25 47.62,41.25 48.75,42.38 v53.12,42.38 | 51.5,6.62 51.5,8 U4.5 | 51.5,6.62 51.5,6.5 52,6 R8.2 51.5,6.38 51.5,6 C16.2 | v54.38,41.12 56.25,39.25 v56.25,35.75 | v56,33.38 54.5,31.88 54.5,20.25 58.25,16.5 58.25,13.38 v57.25,12.38 | 51.5,6.62 v55.75,10.88
  Bottom 0.178: v54.38,41.12 v53.12,42.38 | v56.25,35.75 56.88,35.12 56.88,33.38 v56,33.38 | v55.75,10.88 v57.25,12.38
N$54  (via drill 0.4)
  Top 0.178: LED_G1.A 70.62,56 70.25,56 LED_G1.A@1 70.12,56 67,59.12 v67,61.75 | LED_G2.C LED_G2.C@1 18.88,62 18.88,65.12 v20.75,67 | v50.25,60.88 46,60.88 46,61.62 v44.38,63.25
  Bottom 0.178: v67,61.75 66.88,61.62 60.88,61.62 60.62,61.88 56.88,61.88 56.62,61.62 53.38,61.62 53.25,61.75 51.12,61.75 v50.25,60.88 | v20.75,67 21.62,67 22.38,66.25 42,66.25 42.45,65.8 44.05,65.8 44.77,65.08 44.77,64.06 44.38,63.66 v44.38,63.25
N$61  (via drill 0.4)
  Top 0.178: LED_G2.A LED_G2.A@1 15.12,62 15.12,56.12 21,50.25 21,41.88 23,39.88 23,38.12 v24.25,36.88 | LED_G3.C LED_G3.C@1 40.88,22 41.5,22.62 41.5,29.5 v41.75,29.75 | v30.62,36.5 36,36.5 38,34.5 v40,34.5
  Bottom 0.178: v24.25,36.88 24.62,36.5 v30.62,36.5 | v40,34.5 41.75,32.75 v41.75,29.75
N$64
  Top 0.178: R9.1 90,39 89.69,38.69 86.77,38.69 86.44,38.37 U5.6
N$65
  Top 0.178: C19.1 77,38.12 78.62,38.12 80.12,39.62 80.5,39.62 U5.2
N$66  (via drill 0.4)
  Top 0.178: 77,40 79.25,40 79.25,40.12 80,40.88 80.5,40.88 | 80.5,40.88 U5.1 | v69.12,36.25 69.88,37 v69.88,37.75 | v72.38,38.75 74.38,40.75 v74.38,48.88 | v76.38,49 77,48.38 77,40 | 77,40 C19.2 | D5.C 80.02,41.36 80.5,40.88
  Bottom 0.178: v69.12,36.25 65.88,33 L5.P0 | v69.88,37.75 70.5,38.38 71,38.38 71.25,38.12 71.75,38.12 v72.38,38.75 | v74.38,48.88 74.5,49 v76.38,49
N$67  (via drill 0.4)
  Top 0.178: v82.23,43.75 82.23,45.15 80.46,46.92 80.03,46.92 C18.1 | v86.88,40.25 86.5,40.25 86,39.75 85.5,39.75 U5.7
  Bottom 0.178: v82.23,43.75 85.73,40.25 v86.88,40.25
N$68  (via drill 0.4)
  Top 0.178: LED_G3.A LED_G3.A@1 37.12,19.38 37.5,19 42.38,19 42.38,20.62 47.38,25.62 v47.38,27.5 | v78,31.12 79.38,31.12 82.5,28 C20.1
  Bottom 0.178: v78,31.12 76.12,33 L5.P1 76.12,32.88 69.26,32.88 63.76,27.38 54.25,27.38 54,27.62 51.62,27.62 51.12,27.12 47.75,27.12 v47.38,27.5
N$69  (via drill 0.4)
  Top 0.178: LED_G1.C 73.5,56 73.88,56 LED_G1.C@1 74,55.88 75,54.88 v75,35.88 | v88.12,28.5 88.12,30 90,31.88 R10.2 | 85.5,28 v86.88,28 | 85.5,28 85.5,36.25 | 85.5,36.25 85.5,37 U5.5 | 85.5,28 C20.2 | v76.38,36.38 77.62,36.38 77.75,36.25 85.5,36.25
  Bottom 0.178: v88.12,28.5 87.62,28 v86.88,28 | v75,35.88 75.5,36.38 v76.38,36.38
N$70  (via drill 0.4)
  Top 0.178: LED_A2.C LED_A2.C@1 18.88,38 19.62,38.75 19.62,49.25 12.75,56.12 12.75,67 16.88,71.12 v16.88,75.5 | LED_A1.A LED_A1.A@1 v43.12,82
  Bottom 0.178: v16.88,75.5 23.38,82 v43.12,82
N$71  (via drill 0.4)
  Top 0.178: LED_A3.C 84.75,33 | LED_A2.A LED_A2.A@1 15.12,38 15.12,40.62 v19,44.5 | 84.75,33 84.75,29.5 84.25,29 84.25,27 84.5,26.75 87.5,26.75 87.5,37.62 v87,38.12 | v70.75,37.75 69.25,39.25 57.25,39.25 57.25,58.88 v56,60.12 | v52.5,59.5 48.75,63.25 47.38,63.25 47.38,65.12 44.25,68.25 v42.75,68.25 | v32.12,68.38 27,68.38 27,61.38 30.38,58 30.38,50.88 27.5,48 25.5,48 25.5,47.75 22.38,44.62 v21.62,44.62 | 84.75,33 LED_A3.C@1
  Bottom 0.178: v87,38.12 86.88,38 78,38 77.38,37.38 71.12,37.38 v70.75,37.75 | v56,60.12 55.38,59.5 v52.5,59.5 | v42.75,68.25 42.62,68.38 v32.12,68.38 | v21.62,44.62 21.5,44.5 v19,44.5
N$82
  Top 0.178: R11.1 20,12 17.38,9.38 15.5,9.38 U6.6
N$83
  Top 0.178: C23.1 6,12 9.25,12 9.25,11.5 10,10.75 10.5,10.75 U6.2
N$84  (via drill 0.4)
  Top 0.178: 8.88,15.38 7.12,15.38 6.75,15 6.75,14.75 6,14 C23.2 | 8.88,15.38 8.88,13.62 10.5,12 U6.1 10.04,12.39 D6.C | v9.75,27.62 8.88,26.75 8.88,15.38
  Bottom 0.178: v9.75,27.62 10.62,27.62 11.75,28.75 L6.P0
N$85  (via drill 0.4)
  Top 0.178: C22.1 10.05,17.82 11.97,15.9 11.97,13.66 v14,11.62 | v17,11.62 16.12,10.75 15.5,10.75 U6.7
  Bottom 0.178: v17,11.62 v14,11.62
N$86  (via drill 0.4)
  Top 0.178: LED_A3.A LED_A3.A@1 81.12,30.38 82.25,29.25 83.75,29.25 v83.75,24.75 | v7.38,14.75 7.38,13 5.12,13 4.88,12.75 4.88,11.12 5.88,11.12 8.12,8.88 8.12,8.38 10.5,6 C24.1 10.62,6 v12.75,3.88 | v82,23 80.62,23 80.62,17.25 84.62,13.25 84.62,12.5 88.5,8.62 89.5,8.62 89.5,5.5 86.12,2.12 15.75,2.12 15.75,2.62 15.38,3 v13.62,3
  Bottom 0.178: v7.38,14.75 7.5,14.62 9.75,14.62 11,15.88 11,26.62 16.62,26.62 18.75,28.75 22,28.75 L6.P1 | v82,23 v83.75,24.75 | v12.75,3.88 v13.62,3
N$87  (via drill 0.4)
  Top 0.178: LED_A1.C 51.75,77 | R12.2 17,6 15.5,7.5 15.5,8 U6.5 15.38,8 15.38,7.88 13.5,6 C24.2 13.38,6 13.38,3.62 13,3.25 13,1.23 2.1,1.23 1.12,2.2 1.12,65.12 v3,67 | 51.75,77 51.75,74.38 49.62,72.25 v43.88,72.25 | 51.75,77 LED_A1.C@1
  Bottom 0.178: v43.88,72.25 41.88,72.25 38.75,69.12 5.12,69.12 v3,67
N$88  (via drill 0.4)
  Top 0.178: LED_RO1.A LED_RO1.A@1 59.12,14.12 59.75,13.5 61.88,13.5 61.88,15.5 63.28,16.9 63.28,22.26 64.01,22.99 68.58,22.99 69.89,24.3 69.89,24.77 71.12,26 v71.12,27 | LED_RO2.C 84.88,62 | v88.38,42.75 84.62,46.5 84.62,59.12 84.88,59.38 84.88,62 | 84.88,62 LED_RO2.C@1
  Bottom 0.178: v71.12,27 87.75,27 89.5,28.75 89.5,33 89.25,33 88.38,33.88 v88.38,42.75
N$89  (via drill 0.4)
  Top 0.178: LED_RO3.C LED_RO3.C@1 29.75,45 31.25,46.5 31.25,63.12 32.12,64 32.12,66.97 32.77,67.62 v35.12,67.62 | LED_RO2.A LED_RO2.A@1 81.12,62 81.12,60.12 v78.12,57.12 | v55,67.62 57.5,65.12 57.5,63.25 59.5,61.25 59.5,60.75 59.88,60.38 62.38,60.38 v62.38,61
  Bottom 0.178: v55,67.62 v35.12,67.62 | v62.38,61 76.62,61 78,59.62 78,57.12 v78.12,57.12
N$92
  Top 0.178: R13.1 38,12 35.38,12 35.38,11.88 32.88,9.38 32.5,9.38 U7.6
N$93
  Top 0.178: C27.1 23,12 24.25,12 25.5,10.75 27.5,10.75 U7.2
N$94  (via drill 0.4)
  Top 0.178: U7.1 27.5,12 24.88,12 23,13.88 C27.2 23.5,13.5 24.75,14.75 24.75,15.62 23,15.62 v19.88,18.75 | v16.62,43 14,40.38 14,24.62 v18.37,20.25 | D7.C 22.73,20.83 v22.73,21.97
  Bottom 0.178: v16.62,43 22,43 22,41.62 23.62,40 28.5,40 29.75,38.75 L7.P0 | v19.88,18.75 v18.37,20.25 18.37,20.3 18.76,20.69 21.45,20.69 v22.73,21.97
N$95  (via drill 0.4)
  Top 0.178: C26.1 26.02,17.96 v26.02,15.76 | v31.88,15.62 32.12,15.38 v32.12,14.38 | v34.75,12.12 34.5,12.12 33.12,10.75 32.5,10.75 U7.7
  Bottom 0.178: v26.02,15.76 26.14,15.62 v31.88,15.62 | v32.12,14.38 32.62,13.88 33,13.88 v34.75,12.12
N$96  (via drill 0.4)
  Top 0.178: LED_RO3.A LED_RO3.A@1 26,45 25.38,44.38 v25.38,34.12 | v18.75,17.88 21.12,15.5 21.12,9 24.5,9 27.5,6 C28.1
  Bottom 0.178: v18.75,17.88 17.25,19.38 17.25,26.62 22.88,26.62 23.25,27 26.62,27 26.75,26.88 27.25,26.88 28.62,28.25 28.88,28.25 | 28.88,28.25 29.75,28.25 L7.P1 28.88,28.25 | v25.38,34.12 25.38,31.74 25.39,31.74 28.88,28.25
N$97  (via drill 0.4)
  Top 0.178: LED_RO1.C 62.75,22 | C28.2 30.5,6 32.38,7.88 32.38,8 U7.5 32.5,8 32.5,7.5 34,6 R14.2 33.75,6.38 35.5,8.12 35.5,9.38 37.88,9.38 39.5,11 39.5,14.25 43.75,18.5 43.75,19.12 45.75,19.12 46,18.88 46,16 v51.12,16 | 62.75,22 62.75,16.88 v60,14.12 | 62.75,22 LED_RO1.C@1
  Bottom 0.178: v60,14.12 59.75,14.38 55.5,14.38 53.88,16 v51.12,16
N$98  (via drill 0.4)
  Top 0.178: LED_PR1.A LED_PR1.A@1 37.12,49.62 42.5,55 v42.5,62.75 | LED_PR2.C LED_PR2.C@1 62.88,56 63,56.12 63,61.62 v61.62,63
  Bottom 0.178: v42.5,62.75 42.62,62.62 55.88,62.62 56.12,62.88 61.5,62.88 v61.62,63
N$99  (via drill 0.4)
  Top 0.178: LED_PR2.A LED_PR2.A@1 58.38,56.75 58.38,61.75 56.88,63.25 55.38,63.25 55.38,63.62 55,64 v55,66 | LED_PR3.C LED_PR3.C@1 41,94 42.25,92.75 42.25,86.88 42.5,86.62 42.5,72.62 v48.88,66.25
  Bottom 0.178: v55,66 54.5,66.5 49.12,66.5 v48.88,66.25
N$100  (via drill 0.4)
  Top 0.178: LED_PR4.C LED_PR4.C@1 v13.75,78 | LED_PR3.A LED_PR3.A@1 37.12,94 34.62,91.5 34.62,84.75 v33.38,83.5
  Bottom 0.178: v13.75,78 19.25,83.5 v33.38,83.5
N$101
  Top 0.178: LED_PR4.A LED_PR4.A@1 4.12,78 2,75.88 2,68.8 3.57,67.23 3.57,58.56 7.75,54.38 7.75,38 | 7.75,38 7.38,38 LED_PR5.C | 7.75,38 LED_PR5.C@1
N$102
  Top 0.178: R15.1 48,29.12 44.75,29.12 44.75,30.5 44,31.25 43.5,31.25 U8.6
N$103
  Top 0.178: C31.1 35,32.12 38.5,32.12 38.5,32.62 U8.2
N$104  (via drill 0.4)
  Top 0.178: v42,33.88 38.62,33.88 U8.1 38.5,34 35,34 C31.2 33.62,32.57 33.52,32.57 33.18,32.23 33.18,29.19 33.02,29.02 D8.C
  Bottom 0.178: v42,33.88 42.88,33 L8.1
N$105  (via drill 0.4)
  Top 0.178: v42,35.38 37.75,35.38 35.12,38 C30.1 | v43.88,37 44.75,36.12 44.75,33.5 44,32.75 43.5,32.75 U8.7
  Bottom 0.178: v42,35.38 43.62,37 v43.88,37
N$106  (via drill 0.4)
  Top 0.178: LED_PR5.A 4.5,38 4.25,38 LED_PR5.A@1 4.12,37.88 4.12,35.25 6.38,33 v8,33 | v36.25,27.25 37.5,26 C32.1 | v34.12,28.12 33.62,28.62 33.62,31.88 v33.75,32
  Bottom 0.178: v36.25,27.25 35.38,28.12 v34.12,28.12 | 34.31,32.56 34.75,33 L8.2 | 34.31,32.56 v33.75,32 | v8,33 8.12,32.88 21.5,32.88 23.38,34.75 23.38,35.75 27.25,35.75 29.75,33.25 29.75,32.62 34.25,32.62 34.31,32.56
N$107  (via drill 0.4)
  Top 0.178: LED_PR1.C LED_PR1.C@1 40.88,45 43.38,42.5 v43.38,40 | R16.2 44,26 43.5,26.5 43.5,30 U8.5 43.38,30.12 43.38,30.38 41.5,30.38 41.12,30 41.12,26.62 40.5,26 C32.2 40.25,26 36.88,29.38 36.88,30.88 34.88,30.88 v34.25,30.25 | v30.38,33.25 30.62,33 30.62,31.33 v31.7,30.25
  Bottom 0.178: v43.38,40 39.75,36.38 33.5,36.38 v30.38,33.25 | v34.25,30.25 v31.7,30.25
N$108  (via drill 0.4)
  Top 0.178: LED_PR6.A 20.5,6 20.25,6 LED_PR6.A@1 20.12,5.88 20.12,3.25 20.75,2.62 57.75,2.62 57.75,11.5 v57.62,11.62 | 62.75,6 62.38,6 LED_PR7.C | v58.88,11.62 61.62,8.88 62.75,8.88 62.75,6 | 62.75,6 LED_PR7.C@1
  Bottom 0.178: v58.88,11.62 v57.62,11.62
N$109  (via drill 0.4)
  Top 0.178: LED_PR7.A 59.5,6 59.25,6 LED_PR7.A@1 59.12,5.88 59.12,3.25 59.5,2.88 74.25,2.88 74.25,6.38 79.5,11.62 80.25,11.62 82.25,9.62 v84.75,9.62 | LED_PR8.C 95.75,21 | v89.12,13.88 93.25,18 95.75,18 95.75,21 | 95.75,21 LED_PR8.C@1
  Bottom 0.178: v84.75,9.62 89,13.88 v89.12,13.88
N$110
  Top 0.178: LED_PR8.A LED_PR8.A@1 91.62,21.5 91.62,41.12 95.75,45.25 95.75,62 | LED_PR9.C 95.75,62 | 95.75,62 LED_PR9.C@1
N$111
  Top 0.178: LED_PR10.C LED_PR10.C@1 80.88,94 84,97.12 96.5,97.12 96.5,86.62 91.62,81.75 91.62,75.75 95.88,71.5 95.88,68.38 92.12,64.62 LED_PR9.A@1 LED_PR9.A
N$112
  Top 0.178: R17.1 70,32 65.5,32 65.5,31.38 U9.6
N$113  (via drill 0.4)
  Top 0.178: v58.12,31.88 55.12,31.88 54.88,31.62 54.88,30.25 56,29.12 C35.1 | v59,32.75 60.5,32.75 U9.2
  Bottom 0.178: v59,32.75 v58.12,31.88
N$114  (via drill 0.4)
  Top 0.178: v59.12,30.75 59.12,30.88 56,30.88 C35.2 57.02,29.93 57.02,28.29 56.13,27.41 D9.C | v60.62,34.75 60.62,34 U9.1
  Bottom 0.178: v59.12,30.75 60.88,32.5 61.5,32.5 L9.1 60.75,32.5 60.62,32.5 v60.62,34.75
N$115  (via drill 0.4)
  Top 0.178: v64.5,36.38 60.75,36.38 59.12,38 C34.1 | v66.75,35.12 66.75,33.5 66,32.75 65.5,32.75 U9.7
  Bottom 0.178: v64.5,36.38 65.75,35.12 v66.75,35.12
N$116  (via drill 0.4)
  Top 0.178: LED_PR10.A LED_PR10.A@1 71.38,94 70.38,93 69.12,93 64.12,88 v64.12,84 | v58.88,28.5 58.88,26.62 59.5,26 C36.1 | v49.5,83.88 52.38,81 52.38,71.38 49.5,68.5 v49.5,65.75 | v52,63.25 56.88,58.38 56.88,35.5 v56.25,34.88
  Bottom 0.178: v58.88,28.5 58.75,28.62 57.5,28.62 53.62,32.5 53.25,32.5 L9.2 53.75,32.5 53.88,32.5 v56.25,34.88 | v64.12,84 64,83.88 v49.5,83.88 | v49.5,65.75 49.88,65.38 49.88,63 51.75,63 v52,63.25
N$117  (via drill 0.4)
  Top 0.178: LED_PR6.C 23.38,6 23.75,6 LED_PR6.C@1 23.88,5.88 26.5,5.88 26.5,5 26.75,4.75 32,4.75 32,5.62 v32.75,6.38 | 65.5,26 C36.2 62.38,26 62.38,28 v59.5,28 | 65.5,26 66,26 R18.2 65.5,26 | 65.5,26 65.5,30 U9.5 | v33.62,7.25 35.12,8.75 35.12,9.88 36.38,11.12 39,11.12 39,11.25 39.12,11.38 39.12,15.12 47.75,23.75 47.75,27 v48.5,27.75
  Bottom 0.178: v33.62,7.25 v32.75,6.38 | v48.5,27.75 48.75,28 54.25,28 54.5,27.75 59.25,27.75 v59.5,28
N$118  (via drill 0.4)
  Top 0.178: LED_FR2.C LED_FR2.C@1 30,77 30.12,77.12 30.12,83.75 27,86.88 27,91.38 31.75,96.12 31.75,96.38 32.38,97 45.12,97 45.12,90.25 47.38,88 47.38,86.88 51.62,82.62 v52.75,82.62 | LED_FR1.A LED_FR1.A@1 v70.12,82
  Bottom 0.178: v52.75,82.62 53.38,82 v70.12,82
N$119  (via drill 0.4)
  Top 0.178: LED_FR2.A LED_FR2.A@1 26.12,77 24.5,75.38 24.5,52.38 v21.62,49.5 | LED_FR3.C 29.75,22 | v19,46.88 13.38,41.25 v13.38,31 | v27,27.5 29.75,24.75 29.75,22 | 29.75,22 LED_FR3.C@1
  Bottom 0.178: v19,46.88 v21.62,49.5 | v13.38,31 13.5,31.12 23.66,31.12 23.82,30.96 23.82,28.08 24.4,27.5 v27,27.5
N$120  (via drill 0.4)
  Top 0.178: LED_FR3.A LED_FR3.A@1 26.12,22 25.12,21 25.12,15.76 25.71,15.17 29.5,15.17 29.5,19 29.75,19.25 32.25,19.25 32.25,17 32.75,16.5 v34.12,16.5 | LED_FR4.C 73.88,22 | 73.88,22 v73.88,15.12 | 73.88,22 LED_FR4.C@1
  Bottom 0.178: v34.12,16.5 34.5,16.88 55.12,16.88 57.25,14.75 62.25,14.75 64,13 71.75,13 v73.88,15.12
N$122
  Top 0.178: R19.1 75,12 72.38,9.38 71.5,9.38 U10.6
N$123  (via drill 0.4)
  Top 0.178: v64.25,13.62 64.25,13.38 63,12.12 C39.1 | v65.5,13.62 65.25,13.38 65.25,11.5 66,10.75 66.5,10.75 U10.2
  Bottom 0.178: v65.5,13.62 v64.25,13.62
N$124  (via drill 0.4)
  Top 0.178: C39.2 63,14 63.75,14 v64.25,14.5 64.25,17.02 64.13,17.14 64.13,18.86 64.27,18.99 D10.C | v66.12,14.5 66.12,12.38 66.5,12 U10.1
  Bottom 0.178: v64.25,14.5 64.88,15.12 66.12,15.12 | 66.12,15.12 70,15.12 L10.P0 | 66.12,15.12 v66.12,14.5
N$125  (via drill 0.4)
  Top 0.178: v70,12.38 69.12,12.38 65.75,15.75 65.75,17.38 65.12,18 C38.1 | v72.75,12.62 72.75,11.5 72,10.75 71.5,10.75 U10.7
  Bottom 0.178: v70,12.38 70.25,12.62 v72.75,12.62
N$126  (via drill 0.4)
  Top 0.178: LED_FR4.A 70.25,22 | C40.1 65.62,6 v68,3.62 68,3.75 68.25,3.75 69.5,5 72.88,5 73.12,5.25 73.12,5.88 78.88,11.62 78.88,19.88 77.12,19.88 75.5,21.5 75.5,25 70.62,25 70.25,24.62 70.25,22 | 70.25,22 LED_FR4.A@1
  Bottom 0.178: v68,3.62 69.12,4.75 70,4.75 L10.P1
N$127  (via drill 0.4)
  Top 0.178: LED_FR1.C LED_FR1.C@1 76.38,77 76.38,77.25 v77.12,78 | 71.5,6.75 71.5,8 U10.5 | 71.5,6.75 71.5,6.5 72,6 R20.2 71.5,6.38 71.5,6 C40.2 | v97,70.88 97.88,70 97.88,35.75 v92.38,30.25 | v78.25,16.12 76.12,14 76.12,11.38 71.5,6.75
  Bottom 0.178: v77.12,78 81.12,74 93.88,74 v97,70.88 | v78.25,16.12 v92.38,30.25
N$129  (via drill 0.4)
  Top 0.178: LED_W5.A LED_W5.A@1 74.62,3.5 74.62,2.62 74.5,2.5 58.25,2.5 v58.25,12.25 | 20.12,21.38 20.12,19.88 19.5,19.25 13.25,19.25 v13.25,18.5 | 20.12,21.38 20.12,22.62 23.5,26 C4.1 | 20.12,21.38 v24.5,17
  Bottom 0.178: v13.25,18.5 13.25,16.5 L1.2 | v58.25,12.25 57.5,13 54,13 51.25,10.25 44.12,10.25 43.25,11.12 39.62,11.12 34.88,15.88 32.5,15.88 31.38,17 v24.5,17
PWM_A  (via drill 0.4)
  Top 0.178: v51.88,30.5 51.75,30.62 51.75,37.88 51.62,38 IC1.10 | v34.75,28.75 34.75,16.25 32.75,14.25 32.75,13.5 v32.5,13.25 | v8,11.38 10,9.38 10.5,9.38 U6.3
  Bottom 0.178: v51.88,30.5 50.12,28.75 v34.75,28.75 | v32.5,13.25 31.5,12.25 8.88,12.25 v8,11.38
PWM_B  (via drill 0.4)
  Top 0.178: v51.12,35.88 50.38,36.62 50.38,38 IC1.8 | v54.12,34.88 54.12,15.75 v53.62,15.25 | v45,10.88 45.25,10.62 45.25,10.25 46.12,9.38 46.5,9.38 U4.3
  Bottom 0.178: v51.12,35.88 52.12,34.88 v54.12,34.88 | v53.62,15.25 53.5,15.38 50.88,15.38 50.5,15.75 49.88,15.75 v45,10.88
PWM_FR  (via drill 0.4)
  Top 0.178: v55.62,36.38 54.5,36.38 53.62,37.25 53.62,38 IC1.13 | v57.5,30.25 58.25,29.5 58.25,17.12 58.75,16.62 58.75,13.88 63.25,9.38 66.5,9.38 U10.3
  Bottom 0.178: v55.62,36.38 56.5,36.38 57.5,35.37 v57.5,30.25
PWM_G  (via drill 0.4)
  Top 0.178: v51.12,36.75 51.12,37.88 51,38 IC1.9 | v78,36.88 79.38,38.25 80.5,38.25 U5.3
  Bottom 0.178: v51.12,36.75 51.38,37 77.88,37 v78,36.88
PWM_PR  (via drill 0.4)
  Top 0.178: 53.56,36.69 57.75,32.5 58.38,32.5 59.5,31.38 60.5,31.38 U9.3 | 53.56,36.69 53,37.25 53,38 IC1.12 | v40.38,27.46 39.41,27.46 37.25,29.62 37.25,31.25 38.5,31.25 U8.3 | v52.62,29.88 53.5,30.75 53.5,36.62 53.56,36.69
  Bottom 0.178: v40.38,27.46 41.29,28.38 51.12,28.38 v52.62,29.88
PWM_RB  (via drill 0.4)
  Top 0.178: v56.25,48.88 56.25,43.88 52.25,39.88 52.25,39.38 50.25,39.38 49.75,38.88 49.75,38.12 IC1.7 | v65.62,48.88 66.38,49.62 66.38,62 67.88,63.5 73,63.5 73,65 73.08,65.08 73.08,65.26 73.08,68.45 73.62,69 73.62,73.62 77.75,77.75 77.75,81 79,82.25 79.5,82.25 U3.3
  Bottom 0.178: v56.25,48.88 56.38,49 65.5,49 v65.62,48.88
PWM_RO  (via drill 0.4)
  Top 0.178: v52.88,39.38 52.38,38.88 52.38,38.12 IC1.11 | v35.38,29.38 35.38,27.88 35.12,27.62 35.12,15.75 v34.5,15.12 | v24.12,15 21.88,15 21.88,11.38 23.88,9.38 27.5,9.38 U7.3
  Bottom 0.178: v52.88,39.38 53.12,39.12 53.12,37.38 50.88,37.38 47.38,33.88 47.38,31.12 46,31.12 44,29.12 35.62,29.12 v35.38,29.38 | v34.5,15.12 34.38,15 v24.12,15
PWM_W  (via drill 0.4)
  Top 0.178: v36.38,35.25 32.74,35.25 32.74,29.25 v27,29.25 | v25.75,29.38 21.25,29.38 21.25,30.5 22,31.25 22.5,31.25 U1.3 | v61.25,62.25 61,62.5 61,65.25 62.5,65.25 U2.3 | v64.25,62.25 65,61.5 v65,50.5 | v55.88,50.5 55.62,50.25 55.62,43.88 51.5,39.75 49.12,39.75 49.12,38.12 IC1.6 49.02,36.73 49.05,36.7 49.05,36.63 48.72,36.3 47.65,36.3 46.89,37.06 44.69,37.06 v43.75,38
  Bottom 0.178: v43.75,38 41,35.25 v36.38,35.25 | v27,29.25 26.88,29.38 v25.75,29.38 | v64.25,62.25 v61.25,62.25 | v65,50.5 64.75,50.25 56.12,50.25 v55.88,50.5
SCL  (via drill 0.4)
  Top 0.178: 46.81,44.94 41.12,50.62 v39.75,50.62 | 46.81,44.94 47,44.75 47,44 IC1.26 | v90.5,69.75 86.75,66 77.12,66 77.12,57.62 75.62,56.12 v75.62,51 | v55,49.88 55,48.1 51.9,45 46.88,45 46.81,44.94
  Bottom 0.178: v39.75,50.62 39.75,50.67 39.42,51 34.88,51 33.25,52.62 33.25,63 27.62,63 26.12,64.5 25.88,64.5 IC2.D1 | v90.5,69.75 91,69.75 92.25,71 X2.3 | v75.62,51 74.5,49.88 v55,49.88
SDA  (via drill 0.4)
  Top 0.178: 45.56,45.56 41.12,50 v40.89,50 | 45.56,45.56 46.38,44.75 46.38,44 IC1.27 | v30.62,50 30.75,50.12 30.75,62.12 28.38,64.5 IC2.D2 | v75.62,50.12 77.5,52 77.5,65.62 89.38,65.62 94.75,71 X2.4 | v45.12,45 45.5,45.38 45.5,45.5 45.56,45.56
  Bottom 0.178: v30.62,50 v40.89,50 | v75.62,50.12 75,49.5 56,49.5 55,48.5 55,45 v45.12,45

## Text on the board
tPlace: © Sören Krusche | 20191202_SoKr_SA_LED_PCB_V1.0
bPlace: © Sören Krusche | C:/Users/Sören/PowerFolders/Studienarbeit/iwf.bmp | C:/Users/Sören/PowerFolders/Studienarbeit/PROTOHAUS.bmp
tNames: LED_PR | LED_RB | LED_W | LED_PR | LED_W | LED_RB | GND A0 VCC | LED_FR | LED_W | LED_PR | LED_FR | LED_B | LED_A | LED_B | 3V3 D4 GND | VCC GND SCL SDA | LED_W | LED_G | LED_RO | LED_PR | LED_B | LED_W | LED_PR | LED_G | LED_RO | LED_PR | LED_W | LED_RB | LED_B | LED_RB | LED_B | LED_PR | LED_A | LED_W | LED_A | 24V D6 | LED_FR | LED_FR | LED_G | LED_B | LED_RO | LED_W | LED_PR | LED_RB | LED_PR | LED_W | LED_PR | LED_W | LED_RB
bNames: FTDI | D8 | Reset | 3V3 VCC 5V | Analog | I2C | 5V VCC 3V3 | Temp / DS18b20 | +24V | 1 | 0 | GND | A0 | I2C Adr | A1 | 1 | 0 | FAN